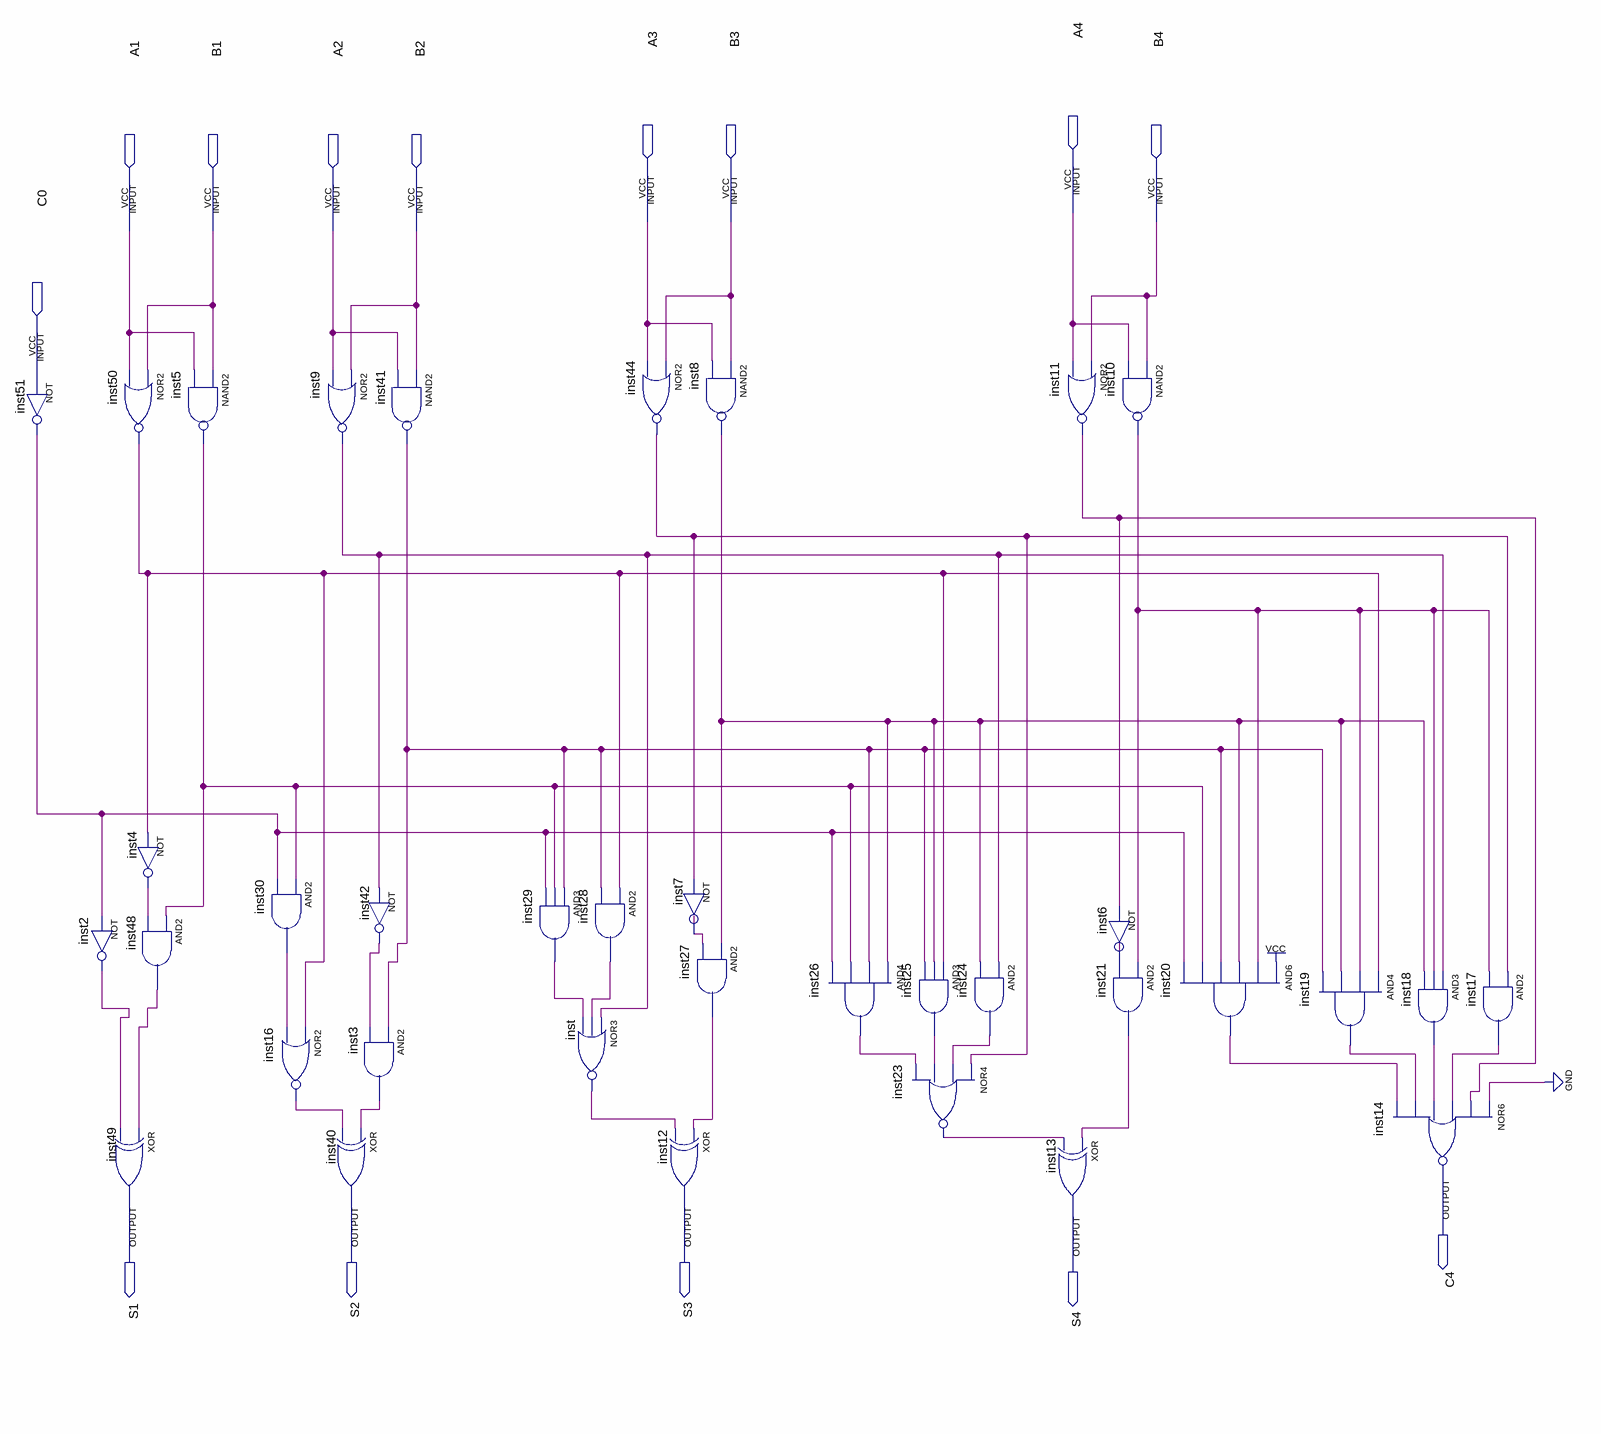
[diagram p0: schematic sheet]
// Quartus schematic ALP74LS283.bdf as structural Verilog: 36 symbols, 14 pins
module ALP74LS283 (
  input  A4,
  input  A3,
  input  B3,
  input  B4,
  input  A1,
  input  B1,
  input  A2,
  input  B2,
  input  C0,
  output C4,
  output S1,
  output S2,
  output S3,
  output S4
);

  wire inst2_out, inst3_out, inst4_out, inst5_out, inst6_out, inst7_out, inst8_out, inst9_out, inst10_out,
       inst11_out, inst16_out, inst17_out, inst18_out, inst19_out, inst20_out, inst21_out, inst23_out,
       inst24_out, inst25_out, inst26_out, inst27_out, inst28_out, inst29_out, inst30_out, inst41_out,
       inst42_out, inst44_out, inst48_out, inst50_out, inst51_out, inst_out;

  not inst51 (inst51_out, C0);
  nor inst50 (inst50_out, B1, A1);
  not inst2 (inst2_out, inst51_out);
  xor inst49 (S1, inst48_out, inst2_out);
  nand inst5 (inst5_out, B1, A1);
  not inst4 (inst4_out, inst50_out);
  and inst48 (inst48_out, inst5_out, inst4_out);
  and inst30 (inst30_out, inst5_out, inst51_out);
  nor inst16 (inst16_out, inst50_out, inst30_out);
  nor inst9 (inst9_out, B2, A2);
  xor inst40 (S2, inst3_out, inst16_out);
  nand inst41 (inst41_out, B2, A2);
  not inst42 (inst42_out, inst9_out);
  and inst3 (inst3_out, inst41_out, inst42_out);
  and inst29 (inst29_out, inst41_out, inst5_out, inst51_out);
  nor inst (inst_out, inst9_out, inst28_out, inst29_out);
  nor inst44 (inst44_out, B3, A3);
  and inst28 (inst28_out, inst50_out, inst41_out);
  nand inst8 (inst8_out, B3, A3);
  not inst7 (inst7_out, inst44_out);
  and inst27 (inst27_out, inst8_out, inst7_out);
  xor inst12 (S3, inst27_out, inst_out);
  and inst26 (inst26_out, inst8_out, inst41_out, inst5_out, inst51_out);
  and inst25 (inst25_out, inst50_out, inst8_out, inst41_out);
  nor inst23 (inst23_out, inst44_out, inst24_out, inst25_out, inst26_out);
  and inst24 (inst24_out, inst9_out, inst8_out);
  nor inst11 (inst11_out, B4, A4);
  xor inst13 (S4, inst21_out, inst23_out);
  nand inst10 (inst10_out, B4, A4);
  not inst6 (inst6_out, inst11_out);
  and inst21 (inst21_out, inst10_out, inst6_out);
  and inst20 (inst20_out, 1'b1, inst10_out, inst8_out, inst41_out, inst5_out, inst51_out);
  and inst19 (inst19_out, inst50_out, inst10_out, inst8_out, inst41_out);
  nor inst14 (C4, 1'b0, inst11_out, inst17_out, inst18_out, inst19_out, inst20_out);
  and inst18 (inst18_out, inst9_out, inst10_out, inst8_out);
  and inst17 (inst17_out, inst44_out, inst10_out);
endmodule
